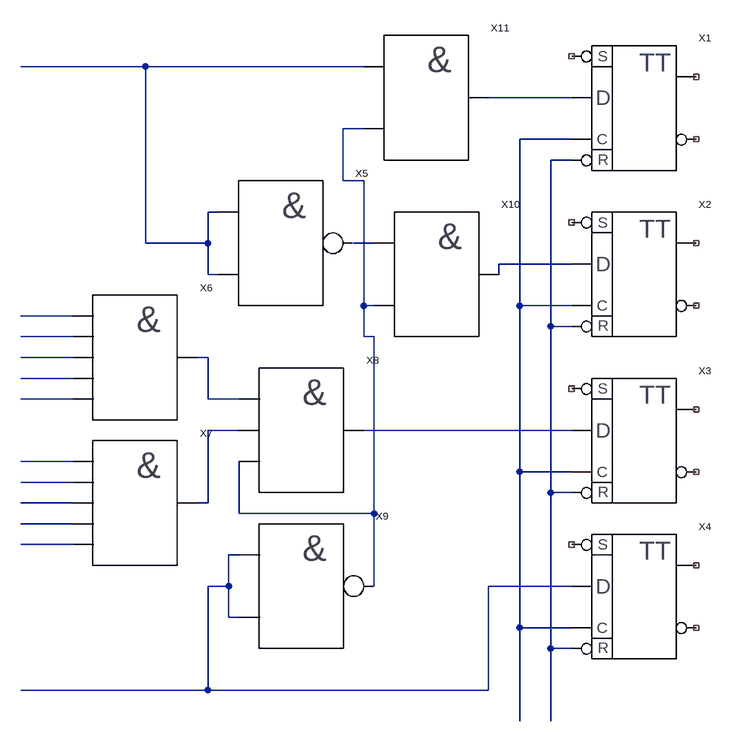
[diagram p0: schematic Draft4.asc]
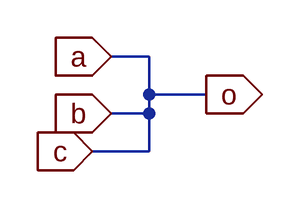
[diagram p1: sub-circuit and3.asc]
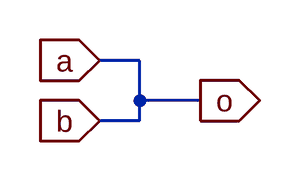
[diagram p2: sub-circuit and2.asc]
Draft4.asc, the LTspice schematic file:
Version 4
SHEET 1 880 1012
WIRE -528 0 -720 0
WIRE -192 0 -528 0
WIRE 128 48 0 48
WIRE -192 96 -224 96
WIRE 128 112 48 112
WIRE 128 144 96 144
WIRE -224 176 -224 96
WIRE -192 176 -224 176
WIRE -416 224 -432 224
WIRE -528 272 -528 0
WIRE -432 272 -432 224
WIRE -432 272 -528 272
WIRE -176 272 -208 272
WIRE 128 304 16 304
WIRE -432 320 -432 272
WIRE -416 320 -432 320
WIRE 16 320 16 304
WIRE -192 368 -192 176
WIRE -176 368 -192 368
WIRE 48 368 48 112
WIRE 128 368 48 368
WIRE -640 384 -720 384
WIRE 96 400 96 144
WIRE 128 400 96 400
WIRE -640 416 -720 416
WIRE -192 416 -192 368
WIRE -176 416 -192 416
WIRE -640 448 -720 448
WIRE -432 448 -448 448
WIRE -640 480 -720 480
WIRE -640 512 -720 512
WIRE -432 512 -432 448
WIRE -384 512 -432 512
WIRE -384 560 -432 560
WIRE 128 560 -192 560
WIRE -640 608 -720 608
WIRE 48 624 48 368
WIRE 128 624 48 624
WIRE -640 640 -720 640
WIRE 96 656 96 400
WIRE 128 656 96 656
WIRE -640 672 -720 672
WIRE -432 672 -432 560
WIRE -432 672 -448 672
WIRE -384 688 -384 608
WIRE -176 688 -176 416
WIRE -176 688 -384 688
WIRE -640 704 -720 704
WIRE -640 736 -720 736
WIRE -384 752 -400 752
WIRE -400 800 -400 752
WIRE -400 800 -432 800
WIRE -176 800 -176 688
WIRE 128 800 0 800
WIRE -400 848 -400 800
WIRE -384 848 -400 848
WIRE 48 864 48 624
WIRE 128 864 48 864
WIRE 96 896 96 656
WIRE 128 896 96 896
WIRE -432 960 -432 800
WIRE -432 960 -720 960
WIRE 0 960 0 800
WIRE 0 960 -432 960
WIRE 48 1008 48 864
WIRE 96 1008 96 896
SYMBOL dTrig 224 64 R0
SYMATTR InstName X1
SYMBOL dTrig 224 320 R0
SYMATTR InstName X2
SYMBOL dTrig 224 576 R0
SYMATTR InstName X3
SYMBOL dTrig 224 816 R0
SYMATTR InstName X4
SYMBOL NAND2 -320 272 R0
SYMATTR InstName X5
SYMBOL AND5 -544 448 R0
SYMATTR InstName X6
SYMBOL AND5 -544 672 R0
SYMATTR InstName X7
SYMBOL NAND2 -288 800 R0
SYMATTR InstName X9
SYMBOL AND3 -288 560 R0
SYMATTR InstName X8
SYMBOL AND2 -80 320 R0
SYMATTR InstName X10
SYMBOL AND2 -96 48 R0
SYMATTR InstName X11

and3.asc, the sub-circuit schematic file:
Version 4
SHEET 1 880 680
WIRE 96 80 64 80
WIRE 96 112 96 80
WIRE 144 112 96 112
WIRE 96 128 96 112
WIRE 96 128 64 128
WIRE 96 160 96 128
WIRE 96 160 48 160
FLAG 64 80 a
IOPIN 64 80 In
FLAG 64 128 b
IOPIN 64 128 In
FLAG 144 112 o
IOPIN 144 112 Out
FLAG 48 160 c
IOPIN 48 160 In

and2.asc, the sub-circuit schematic file:
Version 4
SHEET 1 880 680
WIRE 96 80 64 80
WIRE 96 112 96 80
WIRE 144 112 96 112
WIRE 96 128 96 112
WIRE 96 128 64 128
FLAG 64 80 a
IOPIN 64 80 In
FLAG 64 128 b
IOPIN 64 128 In
FLAG 144 112 o
IOPIN 144 112 Out

The netlist it stands for:
* Draft4.asc
XX1 NC_01 N002 N004 N005 NC_02 NC_03 dTrig  ; pins s d c r q nq
XX2 NC_04 N007 N004 N005 NC_05 NC_06 dTrig  ; pins s d c r q nq
XX3 NC_07 N015 N004 N005 NC_08 NC_09 dTrig  ; pins s d c r q nq
XX4 NC_10 N021 N004 N005 NC_11 NC_12 dTrig  ; pins s d c r q nq
XX5 N001 N001 N006 NAND2  ; pins a b o
XX6 N008 N013 N011 N009 N012 N010 AND5  ; pins a b o c d e
XX7 N016 N020 N014 N017 N019 N018 AND5  ; pins a b o c d e
XX9 N021 N021 N003 NAND2  ; pins a b o
XX8 N011 N003 N015 N014 and3
XX10 N006 N003 N007 and2
XX11 N001 N003 N002 and2

* block symbol definitions
.subckt and3 a b o c
.ends and3

.subckt and2 a b o
.ends and2

.backanno
.end